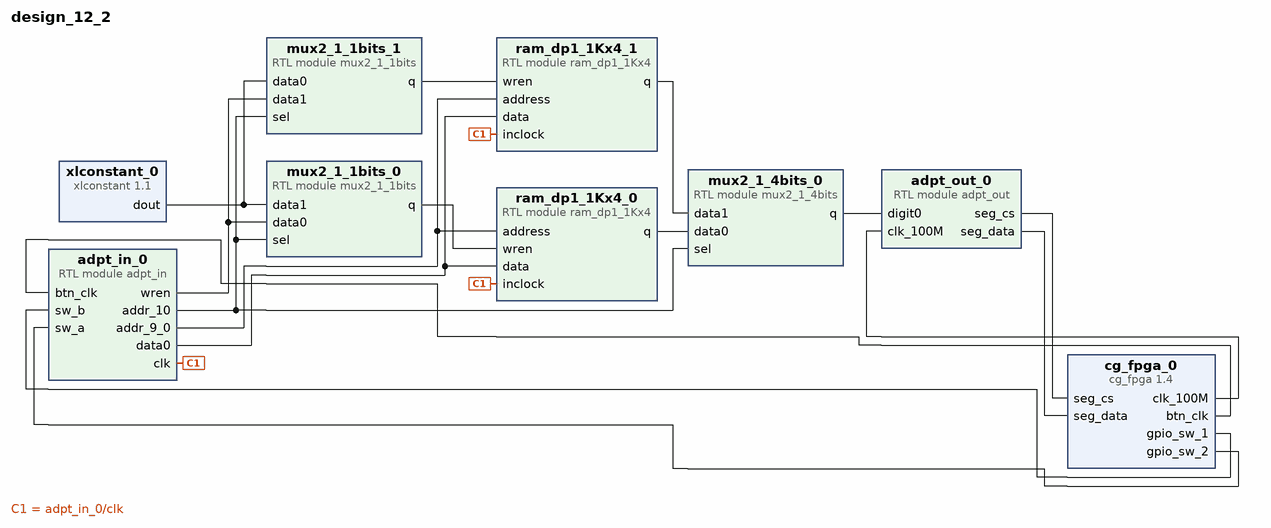
[diagram p0: block diagram of the top level]
# Vivado block design design_12_2, xc7z020clg400-1, Vivado 2024.2
create_bd_design design_12_2

create_bd_cell -type ip -vlnv educg.net:user:cg_fpga:1.4 cg_fpga_0
create_bd_cell -type module -reference ram_dp1_1Kx4 ram_dp1_1Kx4_0
create_bd_cell -type module -reference ram_dp1_1Kx4 ram_dp1_1Kx4_1
create_bd_cell -type module -reference mux2_1_4bits mux2_1_4bits_0
create_bd_cell -type module -reference adpt_in adpt_in_0
create_bd_cell -type module -reference adpt_out adpt_out_0
create_bd_cell -type module -reference mux2_1_1bits mux2_1_1bits_0
create_bd_cell -type module -reference mux2_1_1bits mux2_1_1bits_1
create_bd_cell -type ip -vlnv xilinx.com:ip:xlconstant:1.1 xlconstant_0
set_property -dict {CONFIG.CONST_VAL 0} [get_bd_cells xlconstant_0]

# ---- connections ----

connect_bd_net [get_bd_pins adpt_in_0/addr_10] [get_bd_pins mux2_1_4bits_0/sel] [get_bd_pins mux2_1_1bits_0/sel] [get_bd_pins mux2_1_1bits_1/sel]
connect_bd_net [get_bd_pins adpt_in_0/addr_9_0] [get_bd_pins ram_dp1_1Kx4_0/address] [get_bd_pins ram_dp1_1Kx4_1/address]
connect_bd_net [get_bd_pins adpt_in_0/clk] [get_bd_pins ram_dp1_1Kx4_1/inclock] [get_bd_pins ram_dp1_1Kx4_0/inclock]
connect_bd_net [get_bd_pins adpt_in_0/data0] [get_bd_pins ram_dp1_1Kx4_0/data] [get_bd_pins ram_dp1_1Kx4_1/data]
connect_bd_net [get_bd_pins adpt_in_0/wren] [get_bd_pins mux2_1_1bits_0/data0] [get_bd_pins mux2_1_1bits_1/data1]
connect_bd_net [get_bd_pins adpt_out_0/seg_cs] [get_bd_pins cg_fpga_0/seg_cs]
connect_bd_net [get_bd_pins adpt_out_0/seg_data] [get_bd_pins cg_fpga_0/seg_data]
connect_bd_net [get_bd_pins cg_fpga_0/btn_clk] [get_bd_pins adpt_in_0/btn_clk]
connect_bd_net [get_bd_pins cg_fpga_0/clk_100M] [get_bd_pins adpt_out_0/clk_100M]
connect_bd_net [get_bd_pins cg_fpga_0/gpio_sw_1] [get_bd_pins adpt_in_0/sw_b]
connect_bd_net [get_bd_pins cg_fpga_0/gpio_sw_2] [get_bd_pins adpt_in_0/sw_a]
connect_bd_net [get_bd_pins mux2_1_1bits_0/q] [get_bd_pins ram_dp1_1Kx4_0/wren]
connect_bd_net [get_bd_pins mux2_1_1bits_1/q] [get_bd_pins ram_dp1_1Kx4_1/wren]
connect_bd_net [get_bd_pins mux2_1_4bits_0/q] [get_bd_pins adpt_out_0/digit0]
connect_bd_net [get_bd_pins ram_dp1_1Kx4_0/q] [get_bd_pins mux2_1_4bits_0/data0]
connect_bd_net [get_bd_pins ram_dp1_1Kx4_1/q] [get_bd_pins mux2_1_4bits_0/data1]
connect_bd_net [get_bd_pins xlconstant_0/dout] [get_bd_pins mux2_1_1bits_0/data1] [get_bd_pins mux2_1_1bits_1/data0]

validate_bd_design
save_bd_design
